# Altium schematic sheet SerialComm.SchDoc
size A
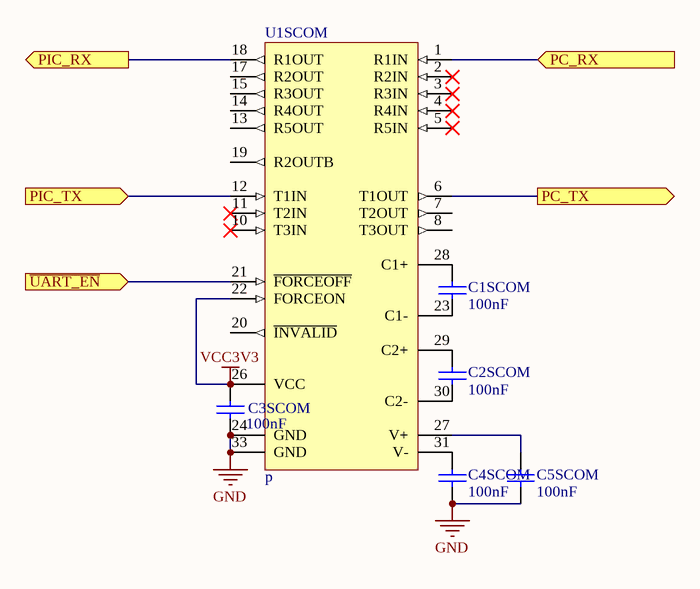
[diagram p0: SerialComm.SchDoc]

## Parts
C1SCOM  value 100nF  [CC1608-0603]  (hidden comment: UMK107BJ104KA-T)
C2SCOM  value 100nF  [CC1608-0603]  (hidden comment: UMK107BJ104KA-T)
C3SCOM  value 100nF  [CC1608-0603]  (hidden comment: UMK107BJ104KA-T)
C4SCOM  value 100nF  [CC1608-0603]  (hidden comment: UMK107BJ104KA-T)
C5SCOM  value 100nF  [CC1608-0603]  (hidden comment: UMK107BJ104KA-T)
U1SCOM  p  [QFN5X5-32]

## Ports
PC_RX (in), PC_TX (out), PIC_RX (out), PIC_TX (in), ~{UART_EN} (in)

## Nets
GND: C3SCOM.2 C4SCOM.2 C5SCOM.2 U1SCOM.24(GND) U1SCOM.33(GND)
VCC3V3: C3SCOM.1 U1SCOM.22(FORCEON) U1SCOM.26(VCC)
PC_RX: U1SCOM.1(R1IN) ; port PC_RX
PC_TX: U1SCOM.6(T1OUT) ; port PC_TX
PIC_RX: U1SCOM.18(R1OUT) ; port PIC_RX
PIC_TX: U1SCOM.12(T1IN) ; port PIC_TX
~{UART_EN}: U1SCOM.21(~{FORCEOFF}) ; port ~{UART_EN}
NetC1SCOM_1: C1SCOM.1 U1SCOM.28(C1+)
NetC1SCOM_2: C1SCOM.2 U1SCOM.23(C1-)
NetC2SCOM_1: C2SCOM.1 U1SCOM.29(C2+)
NetC2SCOM_2: C2SCOM.2 U1SCOM.30(C2-)
NetC4SCOM_1: C4SCOM.1 U1SCOM.31(V-)
NetC5SCOM_1: C5SCOM.1 U1SCOM.27(V+)

Not connected (* = marked no-connect by the designer): U1SCOM 2(R2IN)* 3(R3IN)* 4(R4IN)* 5(R5IN)* 7(T2OUT) 8(T3OUT) 10(T3IN)* 11(T2IN)* 13(R5OUT) 14(R4OUT) 15(R3OUT) 17(R2OUT) 19(R2OUTB) 20(~{INVALID})

## Library data of the parts
C1SCOM C2SCOM C3SCOM C4SCOM C5SCOM = Cap: Capacitor; Manufacturer: Taiyo Yuden; Distributor: Digikey; OrderCode: UMK107BJ104KA-T
U1SCOM = MAX3243E_SMALL: RS232 Transceiver; Manufacturer: Texas Instruments; OrderCode: MAX3243EIRHBR; Distributor: Digikey